# Altium schematic sheet ExtensionConnector.SchDoc: Extension Connectors
size A4; DocumentNumber: MB1165; Revision: C.1; SheetNumber: 14; SheetTotal: 17; Project: STM32469I-EVAL
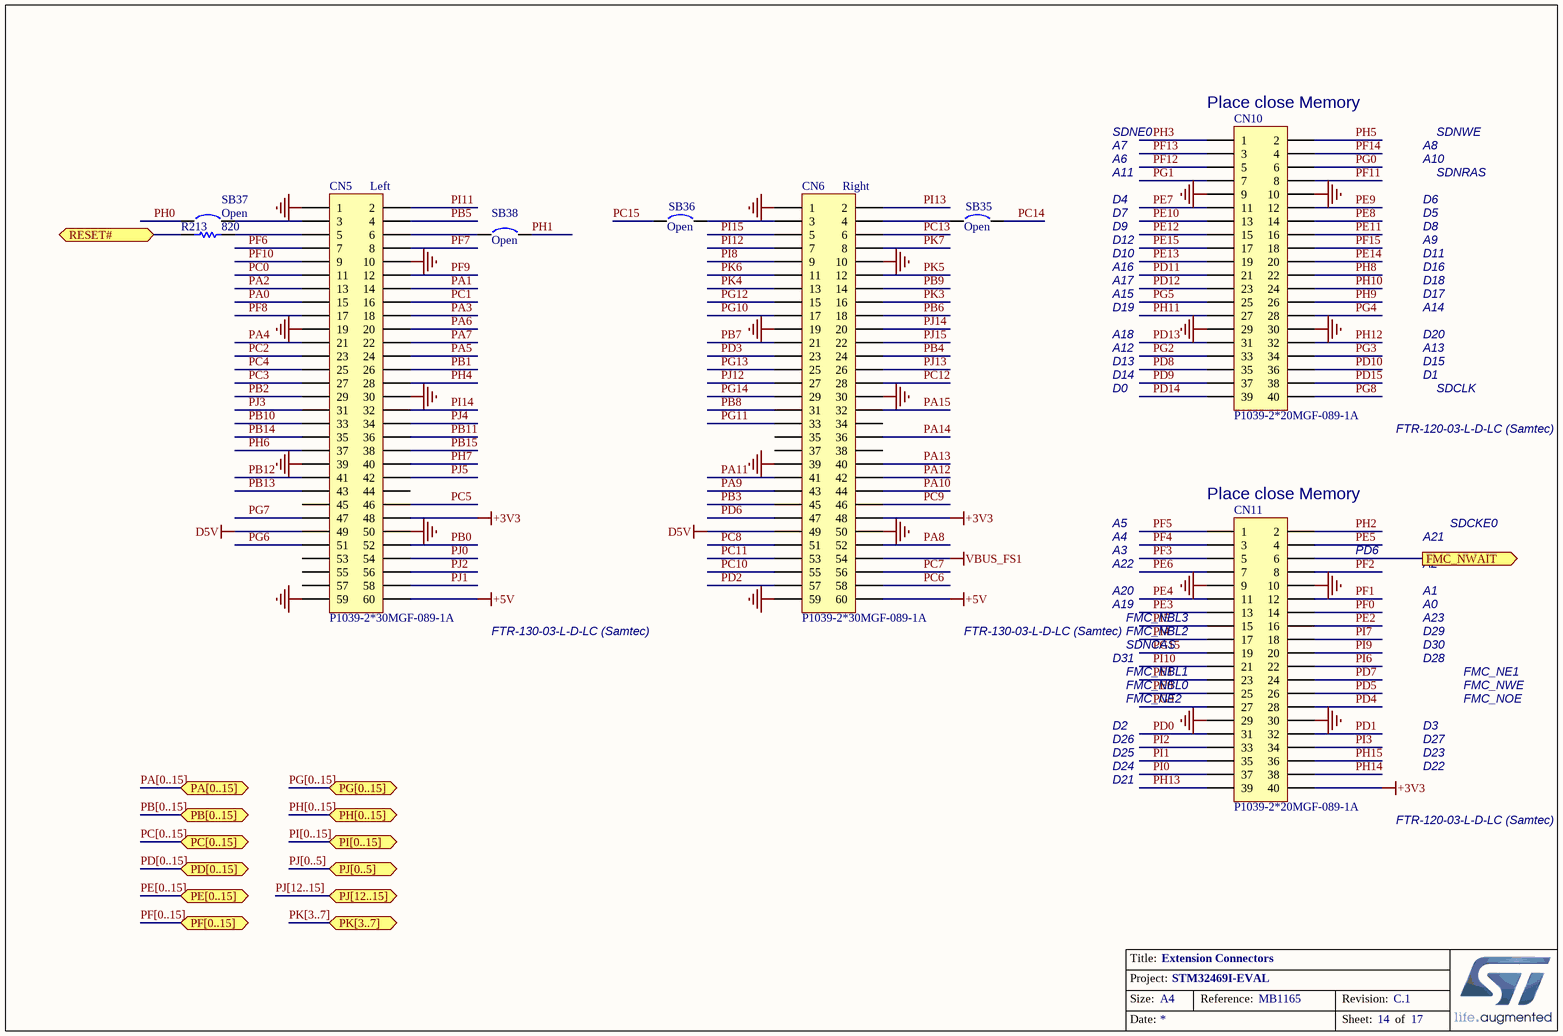
[diagram p0: ExtensionConnector.SchDoc]

## Parts
CN5  P1039-2*30MGF-089-1A  [FTR-130-53-L-D-LC]
CN6  P1039-2*30MGF-089-1A  [FTR-130-53-L-D-LC]
CN10  P1039-2*20MGF-089-1A  [FTR-120-53-L-D-LC]
CN11  P1039-2*20MGF-089-1A  [FTR-120-53-L-D-LC]
R213  820  [0603R]
SB35  Open  [SB_0603]
SB36  Open  [SB_0603]
SB37  Open  [SB_0603]
SB38  Open  [SB_0603]

## Ports
FMC_NWAIT (out), PA[0..15] (bidir), PB[0..15] (bidir), PC[0..15] (bidir), PD[0..15] (bidir), PE[0..15] (bidir), PF[0..15] (bidir), PG[0..15] (bidir), PH[0..15] (bidir), PI[0..15] (bidir), PJ[0..5] (bidir), PJ[12..15] (bidir), PK[3..7] (bidir), RESET# (bidir)

## Nets
+3V3: CN5.48 CN6.48 CN11.40
+5V: CN5.60 CN6.60
D5V: CN5.49 CN6.49
GND: CN5.1 CN5.10 CN5.19 CN5.30 CN5.39 CN5.50 CN5.59 CN6.1 CN6.10 CN6.19 CN6.30 CN6.39 CN6.50 CN6.59 CN10.9 CN10.10 CN10.29 CN10.30 CN11.9 CN11.10 CN11.29 CN11.30
VBUS_FS1: CN6.54
FMC_NWAIT: CN11.6 ; port FMC_NWAIT
PA0: CN5.15
PA1: CN5.14
PA2: CN5.13
PA3: CN5.18
PA4: CN5.21
PA5: CN5.24
PA6: CN5.20
PA7: CN5.22
PA8: CN6.52
PA9: CN6.43
PA10: CN6.44
PA11: CN6.41
PA12: CN6.42
PA13: CN6.40
PA14: CN6.36
PA15: CN6.32
PB0: CN5.52
PB1: CN5.26
PB2: CN5.29
PB3: CN6.45
PB4: CN6.24
PB5: CN5.4
PB6: CN6.18
PB7: CN6.21
PB8: CN6.31
PB9: CN6.14
PB10: CN5.33
PB11: CN5.36
PB12: CN5.41
PB13: CN5.43
PB14: CN5.35
PB15: CN5.38
PC0: CN5.11
PC1: CN5.16
PC2: CN5.23
PC3: CN5.27
PC4: CN5.25
PC5: CN5.46
PC6: CN6.58
PC7: CN6.56
PC8: CN6.51
PC9: CN6.46
PC10: CN6.55
PC11: CN6.53
PC12: CN6.28
PC13: CN6.6
PC14: SB35.1
PC15: SB36.1
PD0: CN11.31
PD1: CN11.32
PD2: CN6.57
PD3: CN6.23
PD4: CN11.28
PD5: CN11.26
PD6: CN6.47
PD7: CN11.24
PD8: CN10.35
PD9: CN10.37
PD10: CN10.36
PD11: CN10.21
PD12: CN10.23
PD13: CN10.31
PD14: CN10.39
PD15: CN10.38
PE0: CN11.25
PE1: CN11.23
PE2: CN11.16
PE3: CN11.13
PE4: CN11.11
PE5: CN11.4
PE6: CN11.7
PE7: CN10.11
PE8: CN10.14
PE9: CN10.12
PE10: CN10.13
PE11: CN10.16
PE12: CN10.15
PE13: CN10.19
PE14: CN10.20
PE15: CN10.17
PF0: CN11.14
PF1: CN11.12
PF2: CN11.8
PF3: CN11.5
PF4: CN11.3
PF5: CN11.1
PF6: CN5.7
PF7: CN5.8
PF8: CN5.17
PF9: CN5.12
PF10: CN5.9
PF11: CN10.8
PF12: CN10.5
PF13: CN10.3
PF14: CN10.4
PF15: CN10.18
PG0: CN10.6
PG1: CN10.7
PG2: CN10.33
PG3: CN10.34
PG4: CN10.28
PG5: CN10.25
PG6: CN5.51
PG7: CN5.47
PG8: CN10.40
PG9: CN11.27
PG10: CN6.17
PG11: CN6.33
PG12: CN6.15
PG13: CN6.25
PG14: CN6.29
PG15: CN11.19
PH0: SB37.1
PH1: SB38.1
PH2: CN11.2
PH3: CN10.1
PH4: CN5.28
PH5: CN10.2
PH6: CN5.37
PH7: CN5.40
PH8: CN10.22
PH9: CN10.26
PH10: CN10.24
PH11: CN10.27
PH12: CN10.32
PH13: CN11.39
PH14: CN11.38
PH15: CN11.36
PI0: CN11.37
PI1: CN11.35
PI2: CN11.33
PI3: CN11.34
PI4: CN11.17
PI5: CN11.15
PI6: CN11.22
PI7: CN11.18
PI8: CN6.9
PI9: CN11.20
PI10: CN11.21
PI11: CN5.2
PI12: CN6.7
PI13: CN6.2
PI14: CN5.32
PI15: CN6.5
PJ0: CN5.54
PJ1: CN5.58
PJ2: CN5.56
PJ3: CN5.31
PJ4: CN5.34
PJ5: CN5.42
PJ12: CN6.27
PJ13: CN6.26
PJ14: CN6.20
PJ15: CN6.22
PK3: CN6.16
PK4: CN6.13
PK5: CN6.12
PK6: CN6.11
PK7: CN6.8
RESET#: R213.1 ; port RESET#
NetCN5_3: CN5.3 SB37.2
NetCN5_5: CN5.5 R213.2
NetCN5_6: CN5.6 SB38.2
NetCN6_3: CN6.3 SB36.2
NetCN6_4: CN6.4 SB35.2

Not connected (* = marked no-connect by the designer): CN5 44 45 53 55 57; CN6 34 35 37 38

## Buses and harness runs
bus PA[0..15] = port PA[0..15]
bus PB[0..15] = port PB[0..15]
bus PC[0..15] = port PC[0..15]
bus PD[0..15] = port PD[0..15]
bus PE[0..15] = port PE[0..15]
bus PF[0..15] = port PF[0..15]
bus PG[0..15] = port PG[0..15]
bus PH[0..15] = port PH[0..15]
bus PI[0..15] = port PI[0..15]
bus PJ[0..5] = port PJ[0..5]
bus PJ[12..15] = port PJ[12..15]
bus PK[3..7] = port PK[3..7]

## Notes on the sheet
- (near CN10) Place close Memory
- A6
- A7
- A11
- SDNE0
- A8
- A10
- SDNRAS
- SDNWE
- (near CN5) Left
- (near CN6) Right
- D4
- D7
- D9
- D12
- D5
- D6
- D8
- A9
- A16
- A17
- D10
- A15
- D19
- D11
- A14
- D16
- D17
- D18
- D13
- D14
- A18
- A12
- D15
- D1
- A13
- D20
- D0
- (near CN10) FTR-120-03-L-D-LC (Samtec)
- SDCLK
- (near CN11) Place close Memory
- A22
- A3
- A4
- A5
- PD6
- A21
- A2
- SDCKE0
- (near CN5) FTR-130-03-L-D-LC (Samtec)
- (near CN6) FTR-130-03-L-D-LC (Samtec)
- A19
- A20
- SDNCAS
- FMC_NBL2
- FMC_NBL3
- A23
- A0
- A1
- D29
- D30
- D31
- FMC_NBL0
- FMC_NBL1
- FMC_NE2
- D28
- FMC_NOE
- FMC_NWE
- FMC_NE1
- D2
- D21
- D24
- D25
- D26
- D3
- D22
- D23
- D27
- (near CN11) FTR-120-03-L-D-LC (Samtec)
- Title:
- Project:
- Size:
- Date:
- Reference:
- Sheet:
- Revision:
- of

## Library data of the parts
CN5 CN6 = FTR-130-53-L-D-LC: Header, 40-Pin, Dual row; Revision: 17-Jul-2002: Re-released for DXP Platform.; Publisher: Altium Limited
CN10 CN11 = FTR-120-53-L-D-LC: Header, 20-Pin, Dual row; Revision: 17-Jul-2002: Re-released for DXP Platform.; Publisher: Altium Limited
R213 = res1: Resistor; Value: 1K; Published: 8-Jun-2000; Revision: July-2002: Re-released for DXP Platform.; Publisher: Altium Limited
SB35-SB38 = Circuit Breaker: Published: 24-Mar-1999; Revision: July-2002: Re-released for DXP Platform.; Publisher: Altium Limited